# Altium project AT89C51.PrjPcb
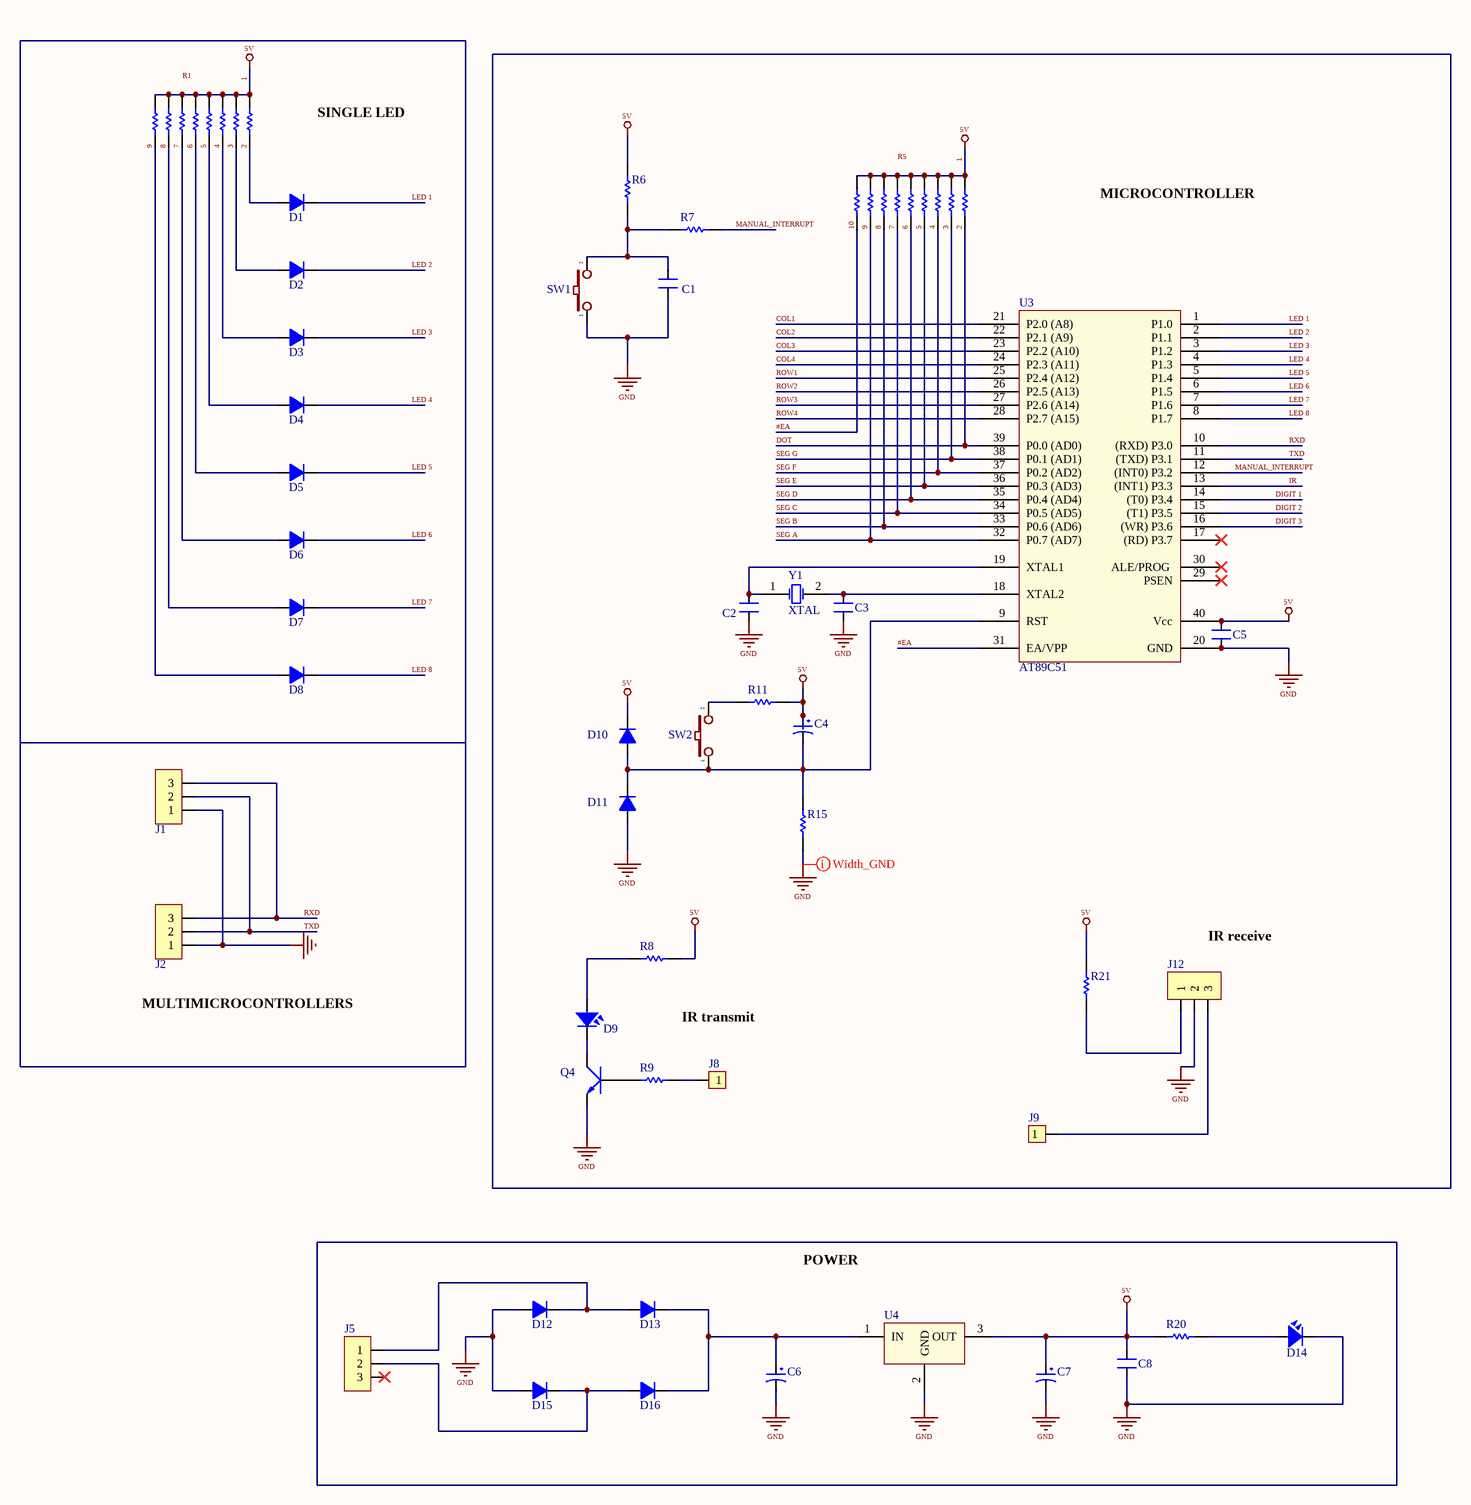
[diagram p0: AT89C51.SchDoc]
1 sheet, 61 parts. Net scope: global (net labels, ports and power ports of the same name join across sheets).
Board file: AT89C51.PcbDoc

## Sheet AT89C51.SchDoc
size A0; SheetNumber: 1; SheetTotal: 1

### Parts
C1  104  [CN2]  (value not drawn)
C2  104  [CN2]  (value not drawn)
C3  104  [CN2]  (value not drawn)
C4  10uF  [tu hoa 13mm]  (value not drawn)
C5  104  [CN2]  (value not drawn)
C6  10uF  [tu hoa 13mm]  (value not drawn)
C7  10uF  [tu hoa 13mm]  (value not drawn)
C8  104  [CN2]  (value not drawn)
D1  100v  [DIODE 0.5A]  (value not drawn)
D2  100v  [DIODE 0.5A]  (value not drawn)
D3  100v  [DIODE 0.5A]  (value not drawn)
D4  100v  [DIODE 0.5A]  (value not drawn)
D5  100v  [DIODE 0.5A]  (value not drawn)
D6  100v  [DIODE 0.5A]  (value not drawn)
D7  100v  [DIODE 0.5A]  (value not drawn)
D8  100v  [DIODE 0.5A]  (value not drawn)
D9  LED  [LED-3]  (value not drawn)
D10  100v  [DIODE 0.5A]  (value not drawn)
D11  100v  [DIODE 0.5A]  (value not drawn)
D12  100v  [DIODE 0.5A]  (value not drawn)
D13  100v  [DIODE 0.5A]  (value not drawn)
D14  LED  [LED-3]  (value not drawn)
D15  100v  [DIODE 0.5A]  (value not drawn)
D16  100v  [DIODE 0.5A]  (value not drawn)
J1  JP 1x3 2.54  [JP 1x3 DT]  (value not drawn)
J2  JP 1x3 2.54  [JP 1x3 DT]  (value not drawn)
J5  JP 1x3 2.54  [JP 1x3 DT]  (value not drawn)
J8  JP 1x1 2.54  [JP 1x1 DT]  (value not drawn)
J9  JP 1x1 2.54  [JP 1x1 DT]  (value not drawn)
J12  JP 1x3 2.54  [JP 1x3 CT]  (value not drawn)
Q4  C1815  [TO92]  (value not drawn)
R6  Res1  [R1/4W]  (value not drawn)
R7  Res1  [R1/4W]  (value not drawn)
R8  Res1  [R1/4W]  (value not drawn)
R9  Res1  [R1/4W]  (value not drawn)
R11  Res1  [R1/4W]  (value not drawn)
R15  Res1  [R1/4W]  (value not drawn)
R20  Res1  [R1/4W]  (value not drawn)
R21  Res1  [R1/4W]  (value not drawn)
R100  Res1  [R1/4W]  (value not drawn)
R101  Res1  [R1/4W]  (value not drawn)
R102  Res1  [R1/4W]  (value not drawn)
R103  Res1  [R1/4W]  (value not drawn)
R104  Res1  [R1/4W]  (value not drawn)
R105  Res1  [R1/4W]  (value not drawn)
R106  Res1  [R1/4W]  (value not drawn)
R107  Res1  [R1/4W]  (value not drawn)
R108  Res1  [R1/4W]  (value not drawn)
R200  Res1  [R1/4W]  (value not drawn)
R201  Res1  [R1/4W]  (value not drawn)
R202  Res1  [R1/4W]  (value not drawn)
R203  Res1  [R1/4W]  (value not drawn)
R204  Res1  [R1/4W]  (value not drawn)
R205  Res1  [R1/4W]  (value not drawn)
R206  Res1  [R1/4W]  (value not drawn)
R207  Res1  [R1/4W]  (value not drawn)
SW1  SW  [SW2]  (value not drawn)
SW2  SW  [SW2]  (value not drawn)
U3  AT89C51  [AT89C51]
U4  LM7805  [QTO-220]  (value not drawn)
Y1  XTAL  [R38]

### Nets
1: C4.1 C5.2 C7.1 C8.2 D10.2(K) R6.2 R8.2 R11.1 R20.1 R21.2 R100.2 R101.2 R102.2 R103.2 R104.2 R105.2 R106.2 R107.2 R108.2 R200.2 R201.2 R202.2 R203.2 R204.2 R205.2 R206.2 R207.2 U3.40(Vcc) U4.3(OUT)  [also labelled 5V]
GND: C1.1 C2.1 C3.1 C5.1 C6.2 C7.2 C8.1 D11.1(A) D12.1(A) D14.2 D15.1(A) J1.1 J2.1 J12.2 Q4.1(E) R15.1 SW1.1 U3.20(GND) U4.2(GND)
2: D1.1(A) R100.1 R200.1 U3.39(P0.0_(AD0))  [also labelled DOT]
3: D2.1(A) R101.1 R201.1 U3.38(P0.1_(AD1))  [also labelled SEG G]
4: D3.1(A) R102.1 R202.1 U3.37(P0.2_(AD2))  [also labelled SEG F]
5: D4.1(A) R103.1 R203.1 U3.36(P0.3_(AD3))  [also labelled SEG E]
6: D5.1(A) R104.1 R204.1 U3.35(P0.4_(AD4))  [also labelled SEG D]
7: D6.1(A) R105.1 R205.1 U3.34(P0.5_(AD5))  [also labelled SEG C]
8: D7.1(A) R106.1 R206.1 U3.33(P0.6_(AD6))  [also labelled SEG B]
9: D8.1(A) R107.1 R207.1 U3.32(P0.7_(AD7))  [also labelled SEG A]
#EA: R108.1 U3.31(EA/VPP)  [also labelled 10]
COL1: U3.21(P2.0_(A8))
COL2: U3.22(P2.1_(A9))
COL3: U3.23(P2.2_(A10))
COL4: U3.24(P2.3_(A11))
DIGIT 1: U3.14((T0)_P3.4)
DIGIT 2: U3.15((T1)_P3.5)
DIGIT 3: U3.16((WR)_P3.6)
IR: U3.13((INT1)_P3.3)
LED 1: D1.2(K) U3.1(P1.0)
LED 2: D2.2(K) U3.2(P1.1)
LED 3: D3.2(K) U3.3(P1.2)
LED 4: D4.2(K) U3.4(P1.3)
LED 5: D5.2(K) U3.5(P1.4)
LED 6: D6.2(K) U3.6(P1.5)
LED 7: D7.2(K) U3.7(P1.6)
LED 8: D8.2(K) U3.8(P1.7)
MANUAL_INTERRUPT: R7.1 U3.12((INT0)_P3.2)
ROW1: U3.25(P2.4_(A12))
ROW2: U3.26(P2.5_(A13))
ROW3: U3.27(P2.6_(A14))
ROW4: U3.28(P2.7_(A15))
RXD: J1.3 J2.3 U3.10((RXD)_P3.0)
TXD: J1.2 J2.2 U3.11((TXD)_P3.1)
NetC1_2: C1.2 R6.1 R7.2 SW1.2
NetC2_2: C2.2 U3.19(XTAL1) Y1.1(OSC1)
NetC3_2: C3.2 U3.18(XTAL2) Y1.2(OSC2)
NetC4_2: C4.2 D10.1(A) D11.2(K) R15.2 SW2.1 U3.9(RST)
NetC6_1: C6.1 D13.2(K) D16.2(K) U4.1(IN)
NetD9_1: D9.1 R8.1
NetD9_2: D9.2 Q4.2(C)
NetD12_2: D12.2(K) D13.1(A) J5.1
NetD14_1: D14.1 R20.2
NetD15_2: D15.2(K) D16.1(A) J5.2
NetJ8_1: J8.1 R9.2
NetJ9_1: J9.1 J12.3
NetJ12_1: J12.1 R21.1
NetQ4_3: Q4.3(B) R9.1
NetR11_2: R11.2 SW2.2

Not connected (* = marked no-connect by the designer): J5 3*; U3 17((RD)_P3.7)* 29(PSEN)* 30(ALE/PROG_)*

### Layout directives
rule Width Constraint [Pref Width = 30mil    Min Width = 30mil    Max Width = 30mil]: GND

### Notes on the sheet
- SINGLE LED
- MICROCONTROLLER
- IR receive
- (near J2) MULTIMICROCONTROLLERS
- IR transmit
- POWER
- Labels drawn without touching a wire or pin: R1, R5

### Library data of the parts
C1-C3 C5 C8 = CN2: Cap np 104 => 105pF; Value: 0.1uF
C4 C6 C7 = Tu Hoa 10uF 450V 13x20: Cắm; Don_Vi: Con; So_Chan: 2; Ten_Linh_Kien: Tụ Hóa 10uF 450V 13x20MM; Ma_Hang: MH003950; Chung_Loai: Cắm; Kieu_Chan: *
D1-D8 D10-D13 D15 D16 = Diode 1N4148: Cắm; Ten_Linh_Kien: Diode 1N4148 DO35 450mA 100V ( 1N4148 DIP); Don_Vi: Con; Ma_Hang: MH001065; Ghi Chu: *; Kieu_Chan: *; Chung_Loai: Cắm
D9 D14 = LED: LED Single colour Green and Red; Value: LED 3 ly Single Colour
J1 J2 J5 = JP 1x3 2.54 Duc Thang: Cắm; Ten_Linh_Kien: Jump Đơn Đực 2.54MM 1x40P Thẳng 11MM; Don_Vi: Con; Ma_Hang: MH000903; Ghi_Chu: *; Kieu_Chan: *; Chung_Loai: Cắm
J8 J9 = JP 1x1 2.54 Duc Cong: Cắm; Ten_Linh_Kien: Jump Đơn Đực 2.54MM 1x40P Cong Đứng; Don_Vi: Con; Ma_Hang: MH000904; Ghi_Chu: *; Kieu_Chan: *; Chung_Loai: Cắm
J12 = JP 1x3 2.54 Cai Thang: Cắm; Ten_Linh_Kien: Jump Đơn Cái 2.54MM 1x20P Thẳng; Don_Vi: Con; Ma_Hang: MH004006; Ghi_Chu: *; Kieu_Chan: *; Chung_Loai: Cắm
Q4 = C1815: NPN transistor; Value: C9014
R6-R9 R11 R15 R20 R21 R100-R108 R200-R207 = Res1_1: Resistor; Manufacturer: Generic Components; Class: Passive; Value: 1K; Published: 08/06/2000; Publisher: Altium Hobart Technology Centre; SubClass: Resistor
SW1 SW2 = SW2: Switch button 2 pin; Value: SW chip 2 pin
U4 = LM78xx: On ap +, from + 5 to + 24VDC; Value: LM7805
Y1 = XTAL: Crystal Oscillator; Published: 8-Jun-2000; LatestRevisionDate: 17-Jul-2002; LatestRevisionNote: Re-released for DXP Platform.; PackageReference: R38; Publisher: Altium Limited; PackageDescription: Crystal, Thru-Hole; 2 Leads; Body 3.1 x 8.2 mm (Dia.xH)